# EAGLE design Noise Percussion main (EAGLE 7.7.0)
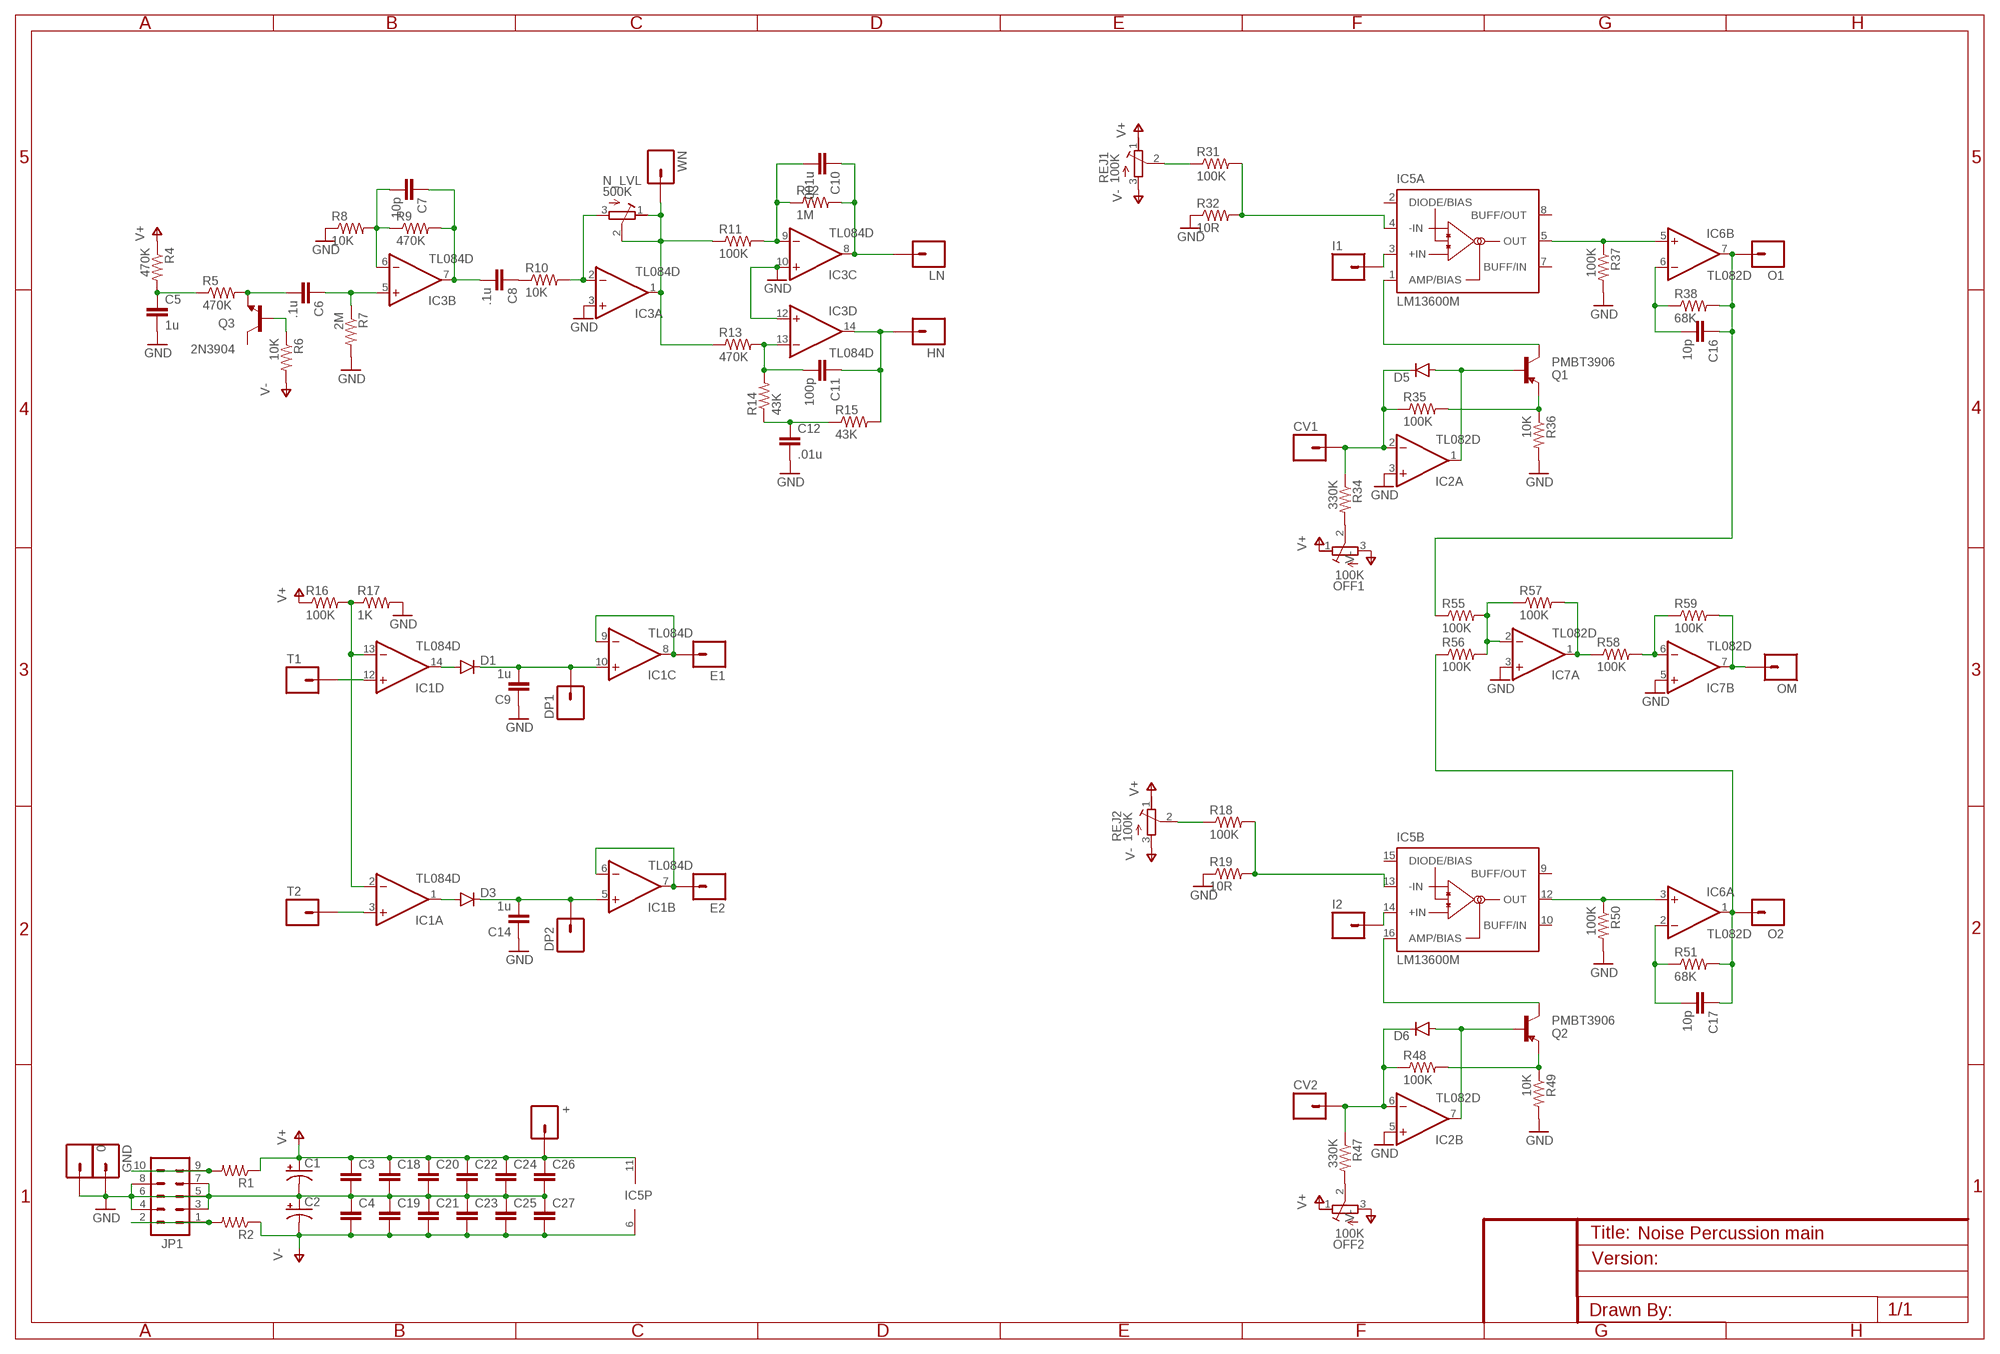
[diagram p0: schematic, sheet 1]

## Parts
0  M01PTH  [1X01]
+  M01PTH  [1X01]
C1  CAP_POLC  [PANASONIC_C]
C2  CAP_POLC  [PANASONIC_C]
C3  CAP0805  [0805]
C4  CAP0805  [0805]
C5  1u  CAP0805  [0805]
C6  .1u  CAP0805  [0805]
C7  10p  CAP0805  [0805]
C8  .1u  CAP0805  [0805]
C9  1u  CAP0805  [0805]
C10  .001u  CAP0805  [0805]
C11  100p  CAP0805  [0805]
C12  .01u  CAP0805  [0805]
C14  1u  CAP0805  [0805]
C16  10p  CAP0805  [0805]
C17  10p  CAP0805  [0805]
C18  CAP0805  [0805]
C19  CAP0805  [0805]
C20  CAP0805  [0805]
C21  CAP0805  [0805]
C22  CAP0805  [0805]
C23  CAP0805  [0805]
C24  CAP0805  [0805]
C25  CAP0805  [0805]
C26  CAP0805  [0805]
C27  CAP0805  [0805]
CV1  M01PTH  [1X01]
CV2  M01PTH  [1X01]
D1  DIODESOD123  [SOD-123]
D3  DIODESOD123  [SOD-123]
D5  DIODESOD123  [SOD-123]
D6  DIODESOD123  [SOD-123]
DP1  M01PTH  [1X01]
DP2  M01PTH  [1X01]
E1  M01PTH  [1X01]
E2  M01PTH  [1X01]
GND  M01PTH  [1X01]
HN  M01PTH  [1X01]
I1  M01PTH  [1X01]
I2  M01PTH  [1X01]
IC1  TL084D  [SO14]
IC2  TL082D  [SO08]
IC3  TL084D  [SO14]
IC5  LM13600M  [SO16]
IC6  TL082D  [SO08]
IC7  TL082D  [SO08]
JP1  M05X2PTH  [AVR_ICSP]
LN  M01PTH  [1X01]
N_LVL  500K  R-TRIMM3314G  [RTRIM3314G]
O1  M01PTH  [1X01]
O2  M01PTH  [1X01]
OFF1  100K  R-TRIMM3314G  [RTRIM3314G]
OFF2  100K  R-TRIMM3314G  [RTRIM3314G]
OM  M01PTH  [1X01]
Q1  PMBT3906  TRANSISTOR_PNPPMBT3906  [SOT23-3]
Q2  PMBT3906  TRANSISTOR_PNPPMBT3906  [SOT23-3]
Q3  2N3904  [TO92]
R1  RESISTOR0805-RES  [0805]
R2  RESISTOR0805-RES  [0805]
R4  470K  RESISTOR0805-RES  [0805]
R5  470K  RESISTOR0805-RES  [0805]
R6  10K  RESISTOR0805-RES  [0805]
R7  2M  RESISTOR0805-RES  [0805]
R8  10K  RESISTOR0805-RES  [0805]
R9  470K  RESISTOR0805-RES  [0805]
R10  10K  RESISTOR0805-RES  [0805]
R11  100K  RESISTOR0805-RES  [0805]
R12  1M  RESISTOR0805-RES  [0805]
R13  470K  RESISTOR0805-RES  [0805]
R14  43K  RESISTOR0805-RES  [0805]
R15  43K  RESISTOR0805-RES  [0805]
R16  100K  RESISTOR0805-RES  [0805]
R17  1K  RESISTOR0805-RES  [0805]
R18  100K  RESISTOR0805-RES  [0805]
R19  10R  RESISTOR0805-RES  [0805]
R31  100K  RESISTOR0805-RES  [0805]
R32  10R  RESISTOR0805-RES  [0805]
R34  330K  RESISTOR0805-RES  [0805]
R35  100K  RESISTOR0805-RES  [0805]
R36  10K  RESISTOR0805-RES  [0805]
R37  100K  RESISTOR0805-RES  [0805]
R38  68K  RESISTOR0805-RES  [0805]
R47  330K  RESISTOR0805-RES  [0805]
R48  100K  RESISTOR0805-RES  [0805]
R49  10K  RESISTOR0805-RES  [0805]
R50  100K  RESISTOR0805-RES  [0805]
R51  68K  RESISTOR0805-RES  [0805]
R55  100K  RESISTOR0805-RES  [0805]
R56  100K  RESISTOR0805-RES  [0805]
R57  100K  RESISTOR0805-RES  [0805]
R58  100K  RESISTOR0805-RES  [0805]
R59  100K  RESISTOR0805-RES  [0805]
REJ1  100K  R-TRIMM3314G  [RTRIM3314G]
REJ2  100K  R-TRIMM3314G  [RTRIM3314G]
T1  M01PTH  [1X01]
T2  M01PTH  [1X01]
WN  M01PTH  [1X01]

## Nets
GND: 0.1 C1.- C2.+ C3.2 C4.1 C5.2 C9.1 C12.2 C14.1 C18.2 C19.1 C20.2 C21.1 C22.2 C23.1 C24.2 C25.1 C26.2 C27.1 GND.1 IC2.3(A:+IN) IC2.5(B:+IN) IC3.3(A:+IN) IC3.10(C:+IN) IC3.12(D:+IN) IC7.3(A:+IN) IC7.5(B:+IN) JP1.3 JP1.4 JP1.5 JP1.6 JP1.7 JP1.8 R7.2 R8.1 R17.2 R19.1 R32.1 R36.2 R37.2 R49.2 R50.2
N$1: JP1.9 JP1.10 R1.2
N$2: JP1.1 JP1.2 R2.2
N$4: I1.1 IC5.3(A:+IN)
N$5: C5.1 R4.2 R5.1
N$6: C6.2 Q3.3(E) R5.2
N$7: C6.1 IC3.5(B:+IN) R7.1
N$8: Q3.2(B) R6.1
N$9: C7.2 IC3.6(B:-IN) R8.2 R9.1
N$10: C7.1 C8.2 IC3.7(B:OUT) R9.2
N$11: C8.1 R10.1
N$12: IC3.2(A:-IN) N_LVL.3(A) R10.2
N$13: IC3.1(A:OUT) N_LVL.1(E) N_LVL.2(S) R11.1 R13.1 WN.1
N$15: C10.2 IC3.9(C:-IN) R11.2 R12.1
N$16: C10.1 IC3.8(C:OUT) LN.1 R12.2
N$17: C11.2 IC3.13(D:-IN) R13.2 R14.2
N$18: C12.1 R14.1 R15.1
N$19: C11.1 HN.1 IC3.14(D:OUT) R15.2
N$20: IC1.3(A:+IN) T2.1
N$21: IC1.12(D:+IN) T1.1
N$22: D1.A IC1.14(D:OUT)
N$23: C9.2 D1.C DP1.1 IC1.10(C:+IN)
N$24: E1.1 IC1.8(C:OUT) IC1.9(C:-IN)
N$25: I2.1 IC5.14(B:+IN)
N$26: R18.1 REJ2.2(S)
N$27: IC5.13(B:-IN) R18.2 R19.2
N$30: IC1.2(A:-IN) IC1.13(D:-IN) R16.2 R17.1
N$31: D3.A IC1.1(A:OUT)
N$32: C14.2 D3.C DP2.1 IC1.5(B:+IN)
N$33: E2.1 IC1.6(B:-IN) IC1.7(B:OUT)
N$39: R31.1 REJ1.2(S)
N$40: IC5.4(A:-IN) R31.2 R32.2
N$41: OFF1.2(S) R34.2
N$43: CV1.1 D5.C IC2.2(A:-IN) R34.1 R35.1
N$44: Q1.2(E) R35.2 R36.1
N$45: D5.A IC2.1(A:OUT) Q1.1(B)
N$47: IC5.1(A:AMP/BIAS) Q1.3(C)
N$48: IC5.5(A:OUT) IC6.5(B:+IN) R37.1
N$49: C16.2 IC6.6(B:-IN) R38.1
N$50: C16.1 IC6.7(B:OUT) O1.1 R38.2 R55.1
N$56: OFF2.2(S) R47.2
N$57: CV2.1 D6.C IC2.6(B:-IN) R47.1 R48.1
N$58: Q2.2(E) R48.2 R49.1
N$59: D6.A IC2.7(B:OUT) Q2.1(B)
N$62: IC5.16(B:AMP/BIAS) Q2.3(C)
N$63: IC5.12(B:OUT) IC6.3(A:+IN) R50.1
N$64: C17.2 IC6.2(A:-IN) R51.1
N$65: C17.1 IC6.1(A:OUT) O2.1 R51.2 R56.1
N$75: IC7.2(A:-IN) R55.2 R56.2 R57.1
N$76: IC7.1(A:OUT) R57.2 R58.1
N$77: IC7.6(B:-IN) R58.2 R59.1
N$78: IC7.7(B:OUT) OM.1 R59.2
V+: +.1 C1.+ C3.1 C18.1 C20.1 C22.1 C24.1 C26.1 IC5.11(P:V+) OFF1.1(E) OFF2.1(E) R1.1 R4.1 R16.1 REJ1.1(E) REJ2.1(E)
V-: C2.- C4.2 C19.2 C21.2 C23.2 C25.2 C27.2 IC5.6(P:V-) OFF1.3(A) OFF2.3(A) R2.1 R6.2 REJ1.3(A) REJ2.3(A)
Unconnected: IC5.2(A:DIODE/BIAS) IC5.7(A:BUFF/IN) IC5.8(A:BUFF/OUT) IC5.9(B:BUFF/OUT) IC5.10(B:BUFF/IN) IC5.15(B:DIODE/BIAS) Q3.1(C)

## Power pins joined to a net without a drawn wire
V+: IC1.4(P:V+) IC2.8(P:V+) IC3.4(P:V+) IC6.8(P:V+) IC7.8(P:V+)
V-: IC1.11(P:V-) IC2.4(P:V-) IC3.11(P:V-) IC6.4(P:V-) IC7.4(P:V-)

## Library data of the parts
0 + CV1 CV2 DP1 DP2 E1 E2 GND HN I1 I2 LN O1 O2 OM T1 T2 WN = SparkFun-Connectors:M01: Header 1 Standard 1-pin 0.1" header. Use with straight break away headers (SKU : PRT-00116), right angle break away headers (PRT-00553), swiss pins (PRT-00743), machine pins (PRT-00117), and female headers (PRT-00115).
C1 C2 = SparkFun-Capacitors:CAP_POL: Capacitor Polarized These are standard SMD and PTH capacitors. Normally 10uF, 47uF, and 100uF in electrolytic and tantalum varieties. Always verify the external diameter of the through hole cap, it varies with capacity, voltage, and manufacturer. The EIA devices should be standard.
C3-C12 C14 C16-C27 = SparkFun-Capacitors:CAP: Capacitor Standard 0603 ceramic capacitor, and 0.1" leaded capacitor.
D1 D3 D5 D6 = SparkFun-DiscreteSemi:DIODE: Diode These are standard reverse protection diodes and small signal diodes. SMA package can handle up to about 1A. SOD-323 can handle about 200mA. What the SOD-323 package when ordering, there are some mfgs out there that are 5-pin packages.
IC1 IC3 = linear:TL084: OP AMP
IC2 IC6 IC7 = linear:TL082: OP AMP Data sheet <http://www.ti.com/lit/ds/symlink/tl084a . pdf>; DATA_SHEET: <a href="http://www.ti.com/lit/ds/symlink/tl084a.pdf"> Data sheet </a>
IC5 = national-semiconductor:LM13600: Dual Operational Transconductance Amplifiers with Linearizing Diodes and Buffers Source: lm13600.PDF
JP1 = SparkFun-Connectors:M05X2: Header 5x2 Standard 10-pin dual row 0.1" header. Commonly used with AVR-ISP. Use with Spark Fun Electronics SKU: PRT-00778
N_LVL OFF1 OFF2 REJ1 REJ2 = rcl:R-TRIMM: Trimm resistor
Q1 Q2 = SparkFun-DiscreteSemi:TRANSISTOR_PNP: Generic PNP BJT Double check pinouts against datasheets- not all devices are the same! MMBT3906 - 40V 200mA SOT-23 (TRANS-08052) MMBT4403 - 40V 600mA SOT-23 (TRANS-09245); PROD_ID: TRANS-08052
Q3 = transistor:2N3904: NPN TRANSISTOR
R1 R2 R4-R19 R31 R32 R34-R38 R47-R51 R55-R59 = SparkFun-Resistors:RESISTOR: Resistor Basic schematic elements and footprints for 0603, 1206, and PTH resistors.

## Board
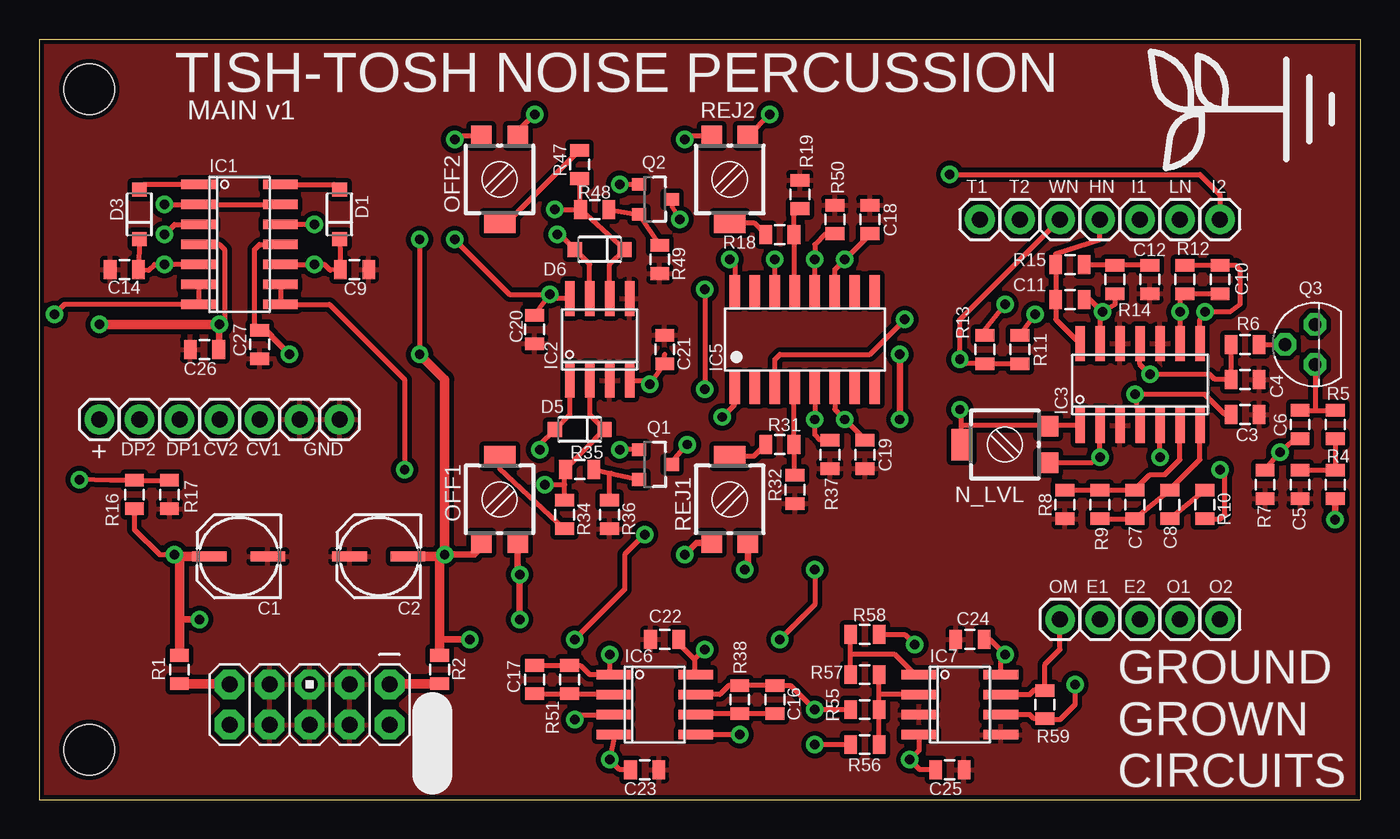
[diagram p1: board, top side]
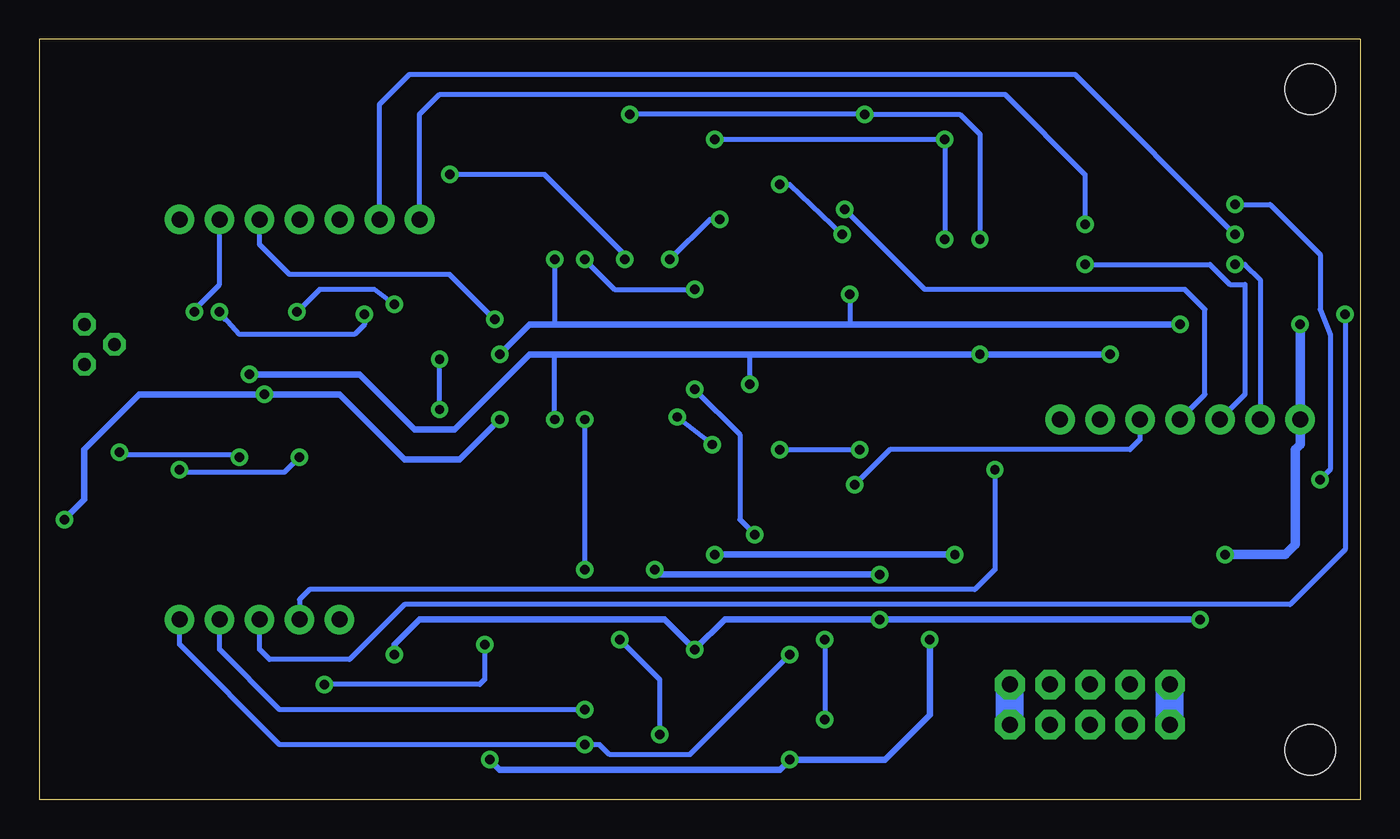
[diagram p2: board, bottom side, seen from below]

Size 83.82 x 48.26 mm. Coordinates in mm from the lower left corner, seen from the top.
Outline: 83.8,0 0,0 0,48.26 83.82,48.26 83.82,0
Copper layers (1*16): Top 0.035mm / dielectric 1.5mm / Bottom 0.035mm
Design rules "SparkFun": minimum track width 8mil, minimum drill 20mil, track to track 8mil, track to pad 8mil, pad to pad 8mil, via to via 8mil, smd to smd 8mil, copper to edge 8mil, drill to drill 8mil, minimum pad ring 12mil, minimum via ring 10mil, stop-mask expansion 4mil, vias tented up to drill 20mil, thermal gap 10mil
Holes 3.2 mm at 3.17,3.17 3.17,45.09

### Footprints (pad centres in the part's own frame; a part is rotated, then mirrored left to right if it is on the bottom)
1X01 = drill 1.016 pad 1.88: 1 0,0
PANASONIC_C = smd 2.2 x 0.65: + 1.9,-0.2; - -1.8,-0.2
0805 = smd 0.8 x 1.2: 1 -0.9,0; 2 0.9,0
SOD-123 = smd 0.9 x 0.95: A 1.575,0; C -1.575,0
SO14 = smd 0.6 x 2.2: 1 -3.81,-2.6; 2 -2.54,-2.6; 3 -1.27,-2.6; 4 0,-2.6; 5 1.27,-2.6; 6 2.54,-2.6; 7 3.81,-2.6; 8 3.81,2.6; 9 2.54,2.6; 10 1.27,2.6; 11 0,2.6; 12 -1.27,2.6; 13 -2.54,2.6; 14 -3.81,2.6
SO08 = smd 0.6 x 2.2: 1 -1.905,-2.6; 2 -0.635,-2.6; 3 0.635,-2.6; 4 1.905,-2.6; 5 1.905,2.6; 6 0.635,2.6; 7 -0.635,2.6; 8 -1.905,2.6
SO16 = smd 0.66 x 2.032: 1 -4.445,-3.073; 2 -3.175,-3.073; 3 -1.905,-3.073; 4 -0.635,-3.073; 5 0.635,-3.073; 6 1.905,-3.073; 7 3.175,-3.073; 8 4.445,-3.073; 9 4.445,3.073; 10 3.175,3.073; 11 1.905,3.073; 12 0.635,3.073; 13 -0.635,3.073; 14 -1.905,3.073; 15 -3.175,3.073; 16 -4.445,3.073
AVR_ICSP = drill 1.016 pad 1.88 octagon: 1 -1.27,5.08; 2 1.27,5.08; 3 -1.27,2.54; 4 1.27,2.54; 5 -1.27,0; 6 1.27,0; 7 -1.27,-2.54; 8 1.27,-2.54; 9 -1.27,-5.08; 10 1.27,-5.08
RTRIM3314G = smd 1.3 x 1.3: 1 1.15,-2.75; 3 -1.15,-2.75 | smd 2 x 1.3: 2 0,2.75
SOT23-3 = smd 0.8 x 0.9: 1 -0.95,-1; 2 0.95,-1; 3 0,1.1
TO92 = drill 0.813 octagon: 1 1.27,0; 2 0,1.905; 3 -1.27,0

### Placement (x,y rotation side)
0  19.05,24.13 0 top
+  3.81,24.13 0 top
C1  12.7,15.24 180 top
C2  21.59,15.24 180 top
C3  76.52,24.45 0 top
C4  76.52,26.67 180 top
C5  80.01,20 270 top
C6  80.01,23.81 90 top
C7  69.53,18.73 90 top
C8  71.75,18.73 90 top
C9  20,33.66 180 top
C10  74.93,33.02 270 top
C11  65.41,31.75 0 top
C12  70.48,33.02 270 top
C14  5.4,33.66 0 top
C16  46.67,6.35 270 top
C17  31.43,7.62 270 top
C18  52.7,36.83 90 top
C19  52.39,21.91 90 top
C20  31.43,29.84 270 top
C21  39.69,28.57 270 top
C22  39.69,10.16 180 top
C23  38.42,1.91 180 top
C24  59.05,10.16 180 top
C25  57.78,1.91 180 top
C26  10.48,28.57 180 top
C27  13.97,28.89 90 top
CV1  13.97,24.13 0 top
CV2  11.43,24.13 0 top
D1  19.05,37.15 90 top
D3  6.35,37.15 90 top
D5  34.29,23.5 180 top
D6  35.56,34.92 180 top
DP1  8.89,24.13 0 top
DP2  6.35,24.13 0 top
E1  67.31,11.43 0 top
E2  69.85,11.43 0 top
GND  16.51,24.13 0 top
HN  67.31,36.83 0 top
I1  69.85,36.83 0 top
I2  74.93,36.83 0 top
IC1  12.7,35.24 270 top
IC2  35.56,29.21 0 top
IC3  69.85,26.35 0 top
IC5  48.58,29.21 0 top
IC6  39.05,6.03 270 top
IC7  58.42,6.03 270 top
JP1  17.14,6.03 270 top
LN  72.39,36.83 0 top
N_LVL  61.28,22.54 90 top
O1  72.39,11.43 0 top
O2  74.93,11.43 0 top
OFF1  29.21,19.05 0 top
OFF2  29.21,39.37 180 top
OM  64.77,11.43 0 top
Q1  39.05,21.27 270 top
Q2  39.05,38.1 270 top
Q3  80.96,28.89 90 top
R1  8.89,8.26 270 top
R2  25.4,8.26 270 top
R4  82.23,20 90 top
R5  82.23,23.81 90 top
R6  76.52,28.89 180 top
R7  77.79,20 270 top
R8  65.09,18.73 90 top
R9  67.31,18.73 270 top
R10  73.98,18.73 270 top
R11  62.23,28.57 90 top
R12  72.71,33.02 90 top
R13  60.01,28.57 90 top
R14  68.26,33.02 270 top
R15  65.41,33.97 180 top
R16  6.03,19.37 90 top
R17  8.26,19.37 270 top
R18  46.99,35.88 0 top
R19  48.26,38.42 270 top
R31  46.99,22.54 0 top
R32  47.94,19.68 90 top
R34  33.34,18.1 270 top
R35  34.29,20.95 0 top
R36  36.2,18.1 270 top
R37  50.16,21.91 270 top
R38  44.45,6.35 90 top
R47  34.29,40.32 90 top
R48  35.24,37.47 0 top
R49  39.37,34.29 270 top
R50  50.48,36.83 90 top
R51  33.66,7.62 90 top
R55  52.39,5.71 0 top
R56  52.39,3.49 0 top
R57  52.39,7.94 180 top
R58  52.39,10.48 0 top
R59  63.82,6.03 90 top
REJ1  43.81,19.05 0 top
REJ2  43.81,39.37 180 top
T1  59.69,36.83 0 top
T2  62.23,36.83 0 top
U$1  [LOGO_MED]  79.06,43.81 90 top
WN  64.77,36.83 0 top

### Tracks (layer width: path | path; a pad name or v marks a point on that pad's centre or on a via)
GND
  pour Top (isolate 0.305): 0,0 0,48.26 83.82,48.26 83.82,0
N$1
  Top 0.61: R1.2 12.01,7.36 JP1.9
  Bottom 1.778: JP1.10 JP1.9
N$2
  Top 0.61: R2.2 22.28,7.36 JP1.1
  Bottom 1.778: JP1.2 JP1.1
N$4  (via drill 0.6)
  Top 0.305: IC5.3 46.67,27.94 46.99,28.26 52.7,28.26 v54.93,30.48
  Bottom 0.305: v54.93,30.48 57.78,33.34 67.94,33.34 69.85,35.24 I1.1
N$5
  Top 0.305: R5.1 R4.2 C5.1
N$6
  Top 0.305: C6.2 80.96,24.71 | 80.96,24.71 R5.2 | Q3.3 80.96,24.71
N$7  (via drill 0.6)
  Top 0.305: C6.1 79.75,22.91 v78.74,22.07 77.79,20.95 R7.1 | v71.12,21.75 IC3.5
  Bottom 0.305: v78.74,22.07 78.74,21.91 71.12,21.91 v71.12,21.75
N$8
  Top 0.305: R6.1 Q3.2
N$9
  Top 0.305: R8.2 R9.1 C7.2 69.53,19.68 70.48,20.64 71.44,20.64 72.39,21.59 IC3.6
N$10
  Top 0.305: R9.2 C7.1 C8.2 71.75,19.68 73.66,21.59 IC3.7
N$11
  Top 0.305: R10.1 C8.1
N$12  (via drill 0.6)
  Top 0.305: R10.2 74.98,17.83 75.25,18.1 75.25,20.64 v74.93,20.95 | IC3.2 v67.31,21.75 66.8,21.39 N_LVL.3
  Bottom 0.305: v74.93,20.95 74.93,20.8 68.26,20.8 v67.31,21.75
N$13  (via drill 0.6)
  Top 0.305: IC3.1 64.09,23.75 | 64.09,23.75 N_LVL.1 | R11.1 R13.1 58.79,27.68 v58.42,27.94 58.42,30.48 WN.1 | N_LVL.2 58.53,23.81 | 58.53,23.81 58.53,24.55 v58.42,24.77 | 64.09,23.75 58.59,23.75 58.53,23.81
  Bottom 0.305: v58.42,24.77 v58.42,27.94
N$15  (via drill 0.6)
  Top 0.305: R11.2 v63.18,30.8 | IC3.9 v72.39,30.96 72.39,31.75 72.71,32.07 R12.1 C10.2
  Bottom 0.305: 72.07,30.48 v72.39,30.96 71.12,29.53 63.82,29.53 63.18,30.16 v63.18,30.8
N$16  (via drill 0.6)
  Top 0.305: IC3.8 73.66,30.48 v73.98,30.96 75.56,30.96 76.2,31.43 76.2,33.66 75.94,33.92 C10.1 R12.2
  Bottom 0.305: v73.98,30.96 73.98,31.11 72.39,32.7 LN.1
N$17  (via drill 0.6)
  Top 0.305: R13.2 60.01,29.84 v61.28,31.43 | v67.47,30.96 67.31,30.48 IC3.13 | R14.2 68.26,31.43 v67.47,30.96 | C11.2 66.67,31.75 v67.47,30.96
  Bottom 0.305: v61.28,31.43 62.55,32.38 66.04,32.38 v67.47,30.96
N$18
  Top 0.305: C12.1 R14.1 66.36,33.92 R15.1
N$19
  Top 0.305: IC3.14 64.5,30.49 C11.1 R15.2 64.5,34.66 67.31,35.56 HN.1
N$20  (via drill 0.6)
  Top 0.305: v7.94,35.88 8.57,36.51 IC1.3
  Bottom 0.305: T2.1 62.23,44.13 60.33,46.04 18.1,46.04 v7.94,35.88
N$21  (via drill 0.6)
  Top 0.305: v17.46,36.51 IC1.12
  Bottom 0.305: T1.1 59.69,43.5 58.42,44.77 22.54,44.77 17.46,39.69 v17.46,36.51
N$22
  Top 0.305: IC1.14 18.72,39.05 D1.A
N$23  (via drill 0.6)
  Top 0.305: D1.C C9.2 18.47,33.6 18.1,33.97 v17.46,33.97 IC1.10
  Bottom 0.305: v17.46,33.97 9.53,33.97 8.26,32.7 7.3,32.7 7.3,25.72 DP1.1
N$24  (via drill 0.6)
  Top 0.305: IC1.9 IC1.8 18.41,31.43 23.18,26.67 v23.18,20.95
  Bottom 0.305: v23.18,20.95 23.18,14.61 24.45,13.34 66.67,13.34 67.31,12.7 E1.1
N$25  (via drill 0.6)
  Top 0.305: IC5.14 v46.67,34.29 | v57.78,39.69 73.66,39.69 74.93,38.42 I2.1
  Bottom 0.305: v46.67,34.29 46.67,34.61 51.75,39.69 v57.78,39.69
N$26
  Top 0.305: REJ2.2 45.35,36.62 R18.1
N$27
  Top 0.305: R19.2 47.89,37.15 R18.2 47.89,32.34 IC5.13
N$30  (via drill 0.6)
  Top 0.305: R17.1 R16.2 4.5,20.27 v2.54,20.32 | v7.94,37.78 IC1.2 IC1.13
  Bottom 0.305: v7.94,37.78 5.71,37.78 2.54,34.61 2.54,31.11 1.91,29.53 1.91,20.95 v2.54,20.32
N$31
  Top 0.305: IC1.1 6.68,39.05 D3.A
N$32  (via drill 0.6)
  Top 0.305: D3.C C14.2 6.93,33.6 7.3,33.97 v7.94,33.97 IC1.5
  Bottom 0.305: v7.94,33.97 7.3,33.97 6.35,33.02 DP2.1
N$33  (via drill 0.6)
  Top 0.305: IC1.6 IC1.7 1.59,31.43 v0.95,30.8
  Bottom 0.305: v0.95,30.8 0.95,15.88 4.45,12.38 60.64,12.38 64.14,8.89 69.22,8.89 69.85,9.53 E2.1
N$39
  Top 0.305: REJ1.2 45.35,21.8 R31.1
N$40
  Top 0.305: R32.2 47.89,20.64 R31.2 47.89,26.08 IC5.4
N$41
  Top 0.305: OFF1.2 29.21,21.01 R34.2
N$43  (via drill 0.6)
  Top 0.305: IC2.2 34.92,24.43 D5.C R35.1 33.34,20.9 33.34,20 | v32.07,20 33.34,20 | R34.1 33.34,20
  Bottom 0.305: CV1.1 13.97,22.86 14.61,22.23 29.84,22.23 v32.07,20
N$44
  Top 0.305: R35.2 36.28,20.71 | 36.28,20.71 Q1.2 | R36.1 36.2,20.63 36.28,20.71
N$45  (via drill 0.6)
  Top 0.305: IC2.1 33.66,24.43 D5.A 31.75,22.53 v31.75,22.23 | Q1.1 v36.83,22.22 v36.83,22.23
  Bottom 0.305: v36.83,22.23 v31.75,22.23
N$47  (via drill 0.6)
  Top 0.305: Q1.3 40.15,21.42 v41.12,22.54 | v43.34,24.29 44.13,25.08 IC5.1
  Bottom 0.305: v41.12,22.54 v43.34,24.29
N$48  (via drill 0.6)
  Top 0.305: IC5.5 v49.21,24.13 49.21,23.18 49.58,22.81 R37.1 | v49.21,14.61 49.21,12.38 v46.99,10.16 | v44.45,4.13 IC6.5
  Bottom 0.305: v49.21,24.13 v49.21,14.61 | v46.99,10.16 44.45,7.62 v44.45,4.13
N$49
  Top 0.305: C16.2 R38.1 41.7,5.45 IC6.6
N$50  (via drill 0.6)
  Top 0.305: IC6.7 43.18,6.67 43.76,7.25 R38.2 C16.1 47.68,7.25 v49.21,5.71 R55.1
  Bottom 0.305: v49.21,5.71 68.58,5.71 72.39,9.53 O1.1
N$56
  Top 0.305: OFF2.2 29.69,36.62 R47.2
N$57  (via drill 0.6)
  Top 0.305: IC2.6 36.2,33.98 D6.C R48.1 | R47.1 34.29,37.52 R48.1 | v32.7,37.47 R48.1
  Bottom 0.305: CV2.1 9.84,25.72 9.84,31.11 11.11,32.38 27.62,32.38 v32.7,37.47
N$58
  Top 0.305: R48.2 Q2.2 R49.1
N$59  (via drill 0.6)
  Top 0.305: IC2.7 34.92,33.98 D6.A 33.03,35.88 v32.86,35.88 | Q2.1 v36.83,39.05
  Bottom 0.305: v36.83,39.05 36.2,39.05 v32.86,35.88
N$62  (via drill 0.6)
  Top 0.305: Q2.3 40.15,37.63 v40.64,36.83 | v43.81,34.29 44.13,33.97 IC5.16
  Bottom 0.305: v40.64,36.83 41.27,36.83 v43.81,34.29
N$63  (via drill 0.6)
  Top 0.305: IC5.12 v49.21,34.29 49.21,35.24 49.9,35.93 R50.1 | v42.23,32.38 v42.23,26.04 | v38.42,16.83 37.15,15.56 37.15,13.34 v33.97,10.16 | v33.97,5.08 34.29,5.4 IC6.3
  Bottom 0.305: v49.21,34.29 47.31,32.38 v42.23,32.38 | v42.23,26.04 39.37,23.18 39.37,17.78 v38.42,16.83 | v33.97,10.16 v33.97,5.08
N$64
  Top 0.305: C17.2 R51.1 36.4,6.72 IC6.2
N$65  (via drill 0.6)
  Top 0.305: C17.1 R51.2 34.34,8.52 34.92,7.94 IC6.1 36.2,8.2 v36.2,9.21 | R56.1 v49.21,3.49
  Bottom 0.305: O2.1 74.93,9.84 68.58,3.49 v49.21,3.49 48.26,3.49 47.62,2.86 42.55,2.86 v36.2,9.21
N$75
  Top 0.305: R56.2 R55.2 53.29,6.67 | 53.29,6.67 R57.1 | IC7.2 53.29,6.67
N$76
  Top 0.305: R57.2 51.49,9.21 | 51.49,9.21 R58.1 | IC7.1 55.56,7.94 54.29,9.21 51.49,9.21
N$77  (via drill 0.6)
  Top 0.305: v65.72,7.3 65.72,6.03 64.77,5.08 63.87,5.08 R59.1 63.13,5.13 62.87,5.4 IC7.6 | R58.2 54.93,10.48 v55.56,9.84
  Bottom 0.305: v55.56,9.84 55.56,7.62 55.88,7.3 v65.72,7.3
N$78
  Top 0.305: IC7.7 62.87,6.67 63.18,6.99 63.77,6.99 R59.2 63.82,8.57 64.77,9.53 OM.1
V+  (via drill 0.6)
  Top 0.305: R16.1 6.03,17.14 7.62,15.56 v8.57,15.56 | IC7.8 61.02,8.95 v61.28,9.21 60.33,10.16 C24.1 | 41.59,8.89 41.59,8 IC6.8 | C22.1 40.59,9.89 41.59,8.89 | IC1.4 11.43,35.24 11.75,34.92 11.75,30.48 v11.43,30.16 | IC3.4 v69.53,25.72 73.98,25.72 75.25,24.45 C3.1 | IC2.8 32.64,31.81 v32.38,32.07 | OFF2.1 26.56,42.12 v26.35,41.91 | REJ2.1 41.17,42.12 v40.96,41.91 | IC5.11 50.48,33.66 v51.12,34.29 52.7,35.88 C18.1 | v42.23,9.53 41.59,8.89 | C20.1 v32.38,32.07 | v26.35,35.56 29.84,32.07 v32.38,32.07
  Top 0.406: v10.16,11.43 8.89,11.43 | OFF1.1 30.36,14.41 v30.48,14.29 v30.48,11.43 | REJ1.1 44.97,14.8 v44.77,14.61 | C26.1 v11.43,30.16 | v54.61,28.26 v54.61,24.13 | v82.23,17.78 R4.1
  Top 0.61: R1.1 8.89,11.43 8.89,15.24 v8.57,15.56 8.69,15.44 C1.+ | v3.81,30.16 v11.43,30.16
  Bottom 0.305: v32.38,32.07 32.38,30.16 | v26.35,35.56 v26.35,41.91 v40.96,41.91 | v51.12,34.29 51.12,30.16
  Bottom 0.406: v61.28,9.21 61.28,9.84 59.69,11.43 44.13,11.43 v42.23,9.53 40.32,11.43 v30.48,11.43 v10.16,11.43 | v44.77,14.61 44.45,14.29 v30.48,14.29 | v11.43,30.16 32.38,30.16 51.12,30.16 52.7,30.16 v54.61,28.26 | v54.61,24.13 57.15,21.59 60.64,21.59 64.77,25.72 v69.53,25.72 77.47,25.72 80.96,22.23 80.96,19.05 v82.23,17.78
  Bottom 0.61: v8.57,15.56 4.76,15.56 4.13,16.19 4.13,22.23 3.81,22.54 +.1 v3.81,30.16
V-  (via drill 0.6)
  Top 0.305: IC7.4 55.82,3.12 v55.24,2.54 55.88,1.91 C25.2 | IC6.4 36.51,4.07 v36.2,2.54 36.83,1.91 C23.2 | C27.2 13.97,29.84 13.65,30.16 13.65,34.92 13.97,35.24 IC1.11 | IC3.11 69.85,27.62 v70.48,26.99 74.3,26.99 74.61,26.67 C4.2 R6.2 | OFF2.3 30.36,42.42 v31.43,43.5 | v46.35,43.5 v46.34,43.5 REJ2.3 | v24.13,35.56 v24.13,28.26 | IC5.6 50.48,24.77 v51.12,24.13 52.39,22.86 C19.2 | IC2.4 38.48,26.61 v38.73,26.35 C21.2 39.69,28.26
  Top 0.406: v27.3,10.16 25.4,10.16 | OFF1.3 28.06,15.99 27.62,15.56 v25.72,15.56 | REJ1.3 41.7,16.3 v40.96,15.56 | v15.88,28.26 15.24,28.89 14.34,29.84 C27.2
  Top 0.61: R2.1 25.4,10.16 25.4,15.24 v25.72,15.56 | C2.- 25.6,15.44 v25.72,15.56 | v25.72,15.56 25.72,26.67 v24.13,28.26
  Bottom 0.305: v46.35,43.5 v31.43,43.5 25.4,43.5 24.13,42.23 v24.13,35.56 | v51.12,24.13 51.12,28.26 | v38.73,26.35 38.73,28.26
  Bottom 0.406: v55.24,2.54 54.61,1.91 36.83,1.91 v36.2,2.54 30.16,2.54 27.3,5.4 v27.3,10.16 | v40.96,15.56 v25.72,15.56 | v15.88,28.26 v24.13,28.26 38.73,28.26 51.12,28.26 52.7,28.26 57.47,23.5 60.01,23.5 63.5,26.99 v70.48,26.99

### Text on the board
tPlace: TISH-TOSH NOISE PERCUSSION | MAIN v1 | GROUND / GROWN / CIRCUITS